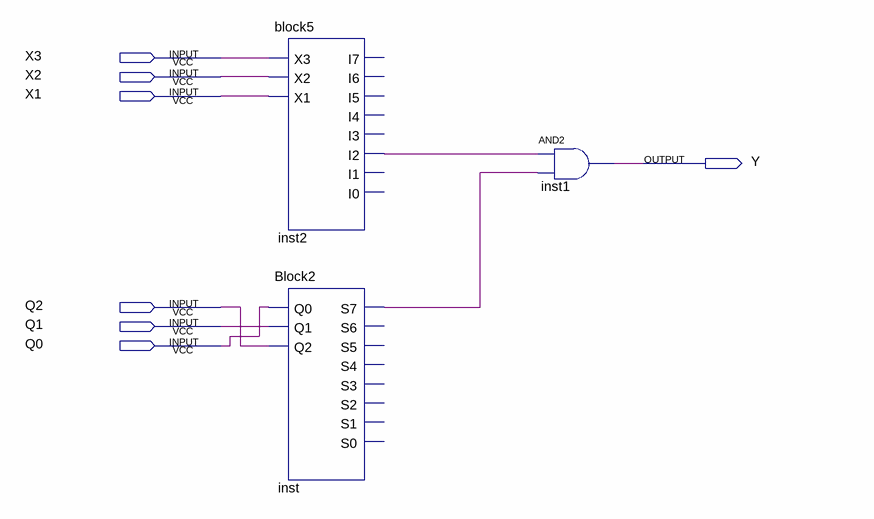
[diagram p0: schematic sheet]
// Quartus schematic block11.bdf as structural Verilog: 3 symbols, 7 pins
module block11 (
  input  X3,
  input  X2,
  input  X1,
  input  Q2,
  input  Q1,
  input  Q0,
  output Y
);

  wire inst2_i2, inst_s7;

  block5 inst2 (.X3(X3), .X2(X2), .X1(X1), .I2(inst2_i2));  // open: I7, I6, I5, I4, I3, I1, I0
  Block2 inst (.Q0(Q0), .Q1(Q1), .Q2(Q2), .S7(inst_s7));  // open: S6, S5, S4, S3, S2, S1, S0
  and inst1 (Y, inst2_i2, inst_s7);
endmodule
